# Altium schematic sheet Sheet1.SchDoc
size A4
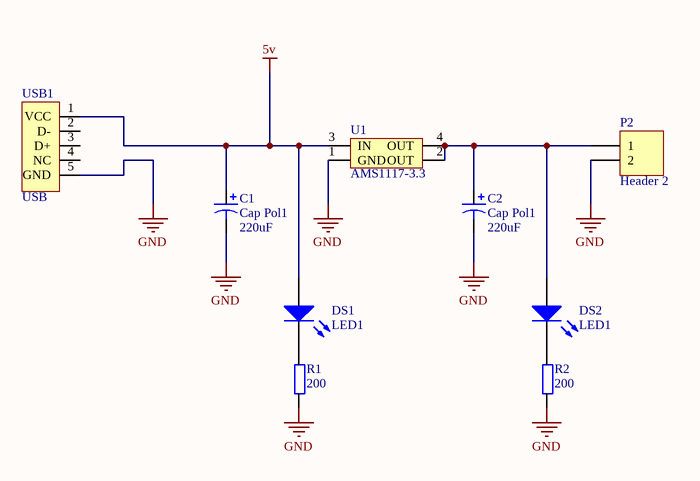
[diagram p0: Sheet1.SchDoc]

## Parts
C1  Cap Pol1  value 220uF  [RB.15/.3]
C2  Cap Pol1  value 220uF  [RB.15/.3]
DS1  LED1  [LED0805]
DS2  LED1  [LED0805]
P2  Header 2  [HDR1X2]
R1  200  [0805]
R2  200  [0805]
U1  AMS1117-3.3  [AMS1117]
USB1  USB  [DIP-2p]

## Nets
5v: C1.1 DS1.1(A) U1.3(IN) USB1.1(VCC)
GND: C1.2 C2.2 P2.2 R1.1 R2.1 U1.1(GND) USB1.5(GND)
NetC2_1: C2.1 DS2.1(A) P2.1 U1.2(OUT) U1.4(OUT)
NetDS1_2: DS1.2(K) R1.2
NetDS2_2: DS2.2(K) R2.2

Not connected (* = marked no-connect by the designer): USB1 2(D-) 3(D+) 4(NC)

## Library data of the parts
C1 C2 = Cap Pol1: Polarized Capacitor (Radial); Published: 8-Jun-2000; LatestRevisionDate: 17-Jul-2002; LatestRevisionNote: Re-released for DXP Platform.; PackageReference: RB7.6-15; Publisher: Altium Limited; PackageDescription: Polarized Capacitor (Radial); 2 Leads
DS1 DS2 = LED2: Typical RED, GREEN, YELLOW, AMBER GaAs LED; Published: 8-Jun-2000; LatestRevisionDate: 17-Jul-2002; LatestRevisionNote: Re-released for DXP Platform.; PackageDocument: Feb-2002; PackageReference: 3.2X1.6X1.1; Publisher: Altium Limited
P2 = Header 2: Header, 2-Pin; LatestRevisionDate: 17-Jul-2002; LatestRevisionNote: Re-released for DXP Platform.; Publisher: Altium Limited
R1 R2 = R
U1 = AMS1117
USB1 = USB5: pin to pad: 2>none 3>none 4>none